# EAGLE design 119_02v2_INTELLIGENT_SENSOR_BOARD (EAGLE 9.6.2)
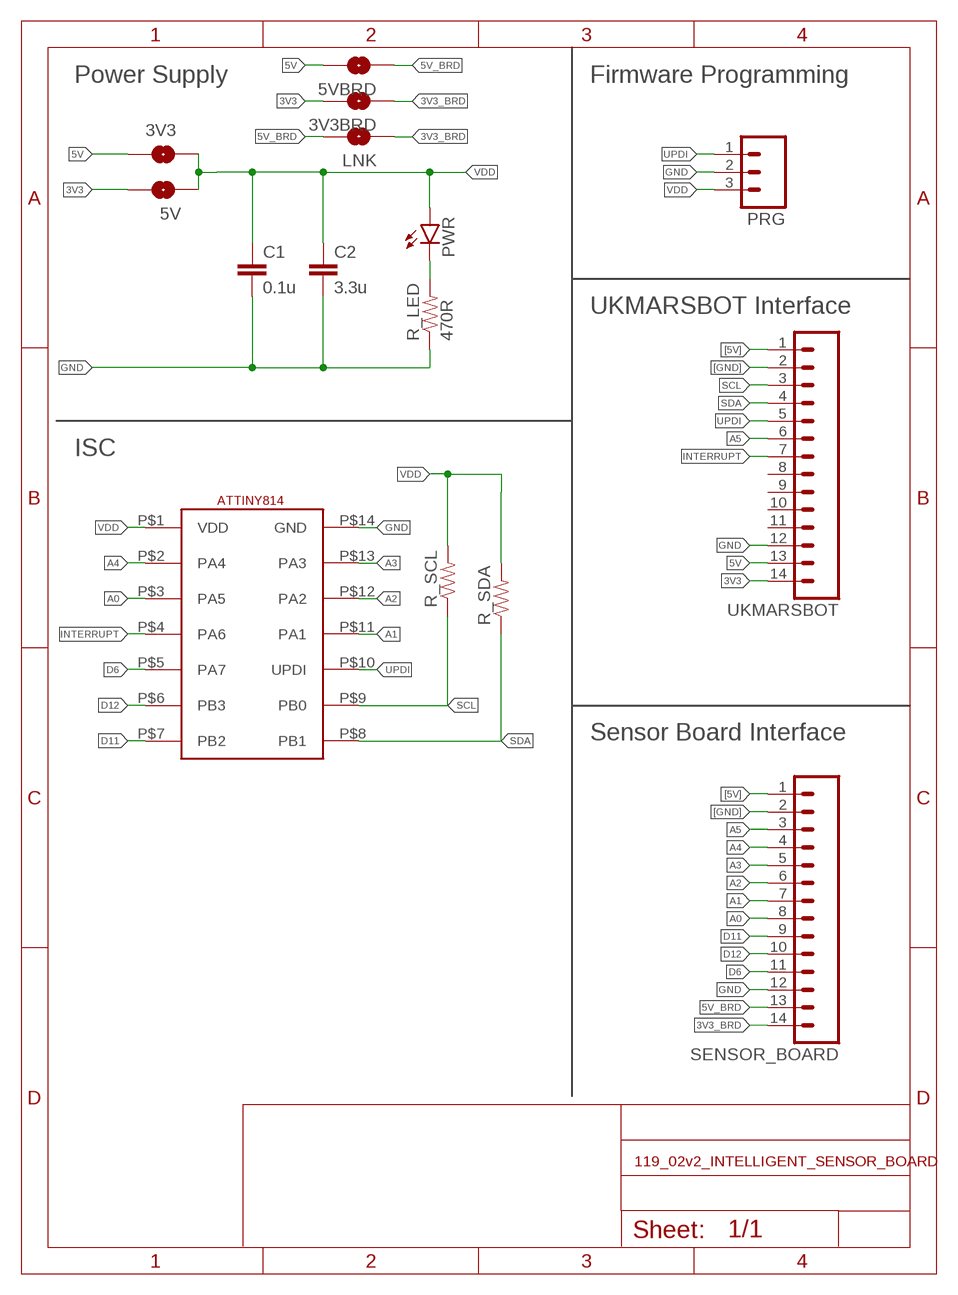
[diagram p0: schematic, sheet 1]

## Parts
3V3  JUMPER-SMT_2_NO_SILK  [SMT-JUMPER_2_NO_SILK]
3V3BRD  JUMPER-SMT_2_NO_SILK  [SMT-JUMPER_2_NO_SILK]
5V  JUMPER-SMT_2_NO_SILK  [SMT-JUMPER_2_NO_SILK]
5VBRD  JUMPER-SMT_2_NO_SILK  [SMT-JUMPER_2_NO_SILK]
C1  0.1u  CAP0805  [0805]
C2  3.3u  CAP0805  [0805]
LNK  JUMPER-SMT_2_NO_SILK  [SMT-JUMPER_2_NO_SILK]
PRG  M03PTH  [1X03]
PWR  LEDCHIP-LED0805  [CHIP-LED0805]
R_LED  470R  RESISTOR0805-RES  [0805]
R_SCL  RESISTOR0805-RES  [0805]
R_SDA  RESISTOR0805-RES  [0805]
SENSOR_BOARD  M14  [1X14]
U$1  ATTINY814  [ATTINY814]
UKMARSBOT  M14  [1X14]

## Nets
3V3: 3V3BRD.2 5V.2 UKMARSBOT.14
3V3_BRD: 3V3BRD.1 LNK.1 SENSOR_BOARD.14
5V: 3V3.2 5VBRD.2 UKMARSBOT.13
5V_BRD: 5VBRD.1 LNK.2 SENSOR_BOARD.13
[5V]: SENSOR_BOARD.1 UKMARSBOT.1
[GND]: SENSOR_BOARD.2 UKMARSBOT.2
A0: SENSOR_BOARD.8 U$1.P$3(PA5)
A1: SENSOR_BOARD.7 U$1.P$11(PA1)
A2: SENSOR_BOARD.6 U$1.P$12(PA2)
A3: SENSOR_BOARD.5 U$1.P$13(PA3)
A4: SENSOR_BOARD.4 U$1.P$2(PA4)
A5: SENSOR_BOARD.3 UKMARSBOT.6
D6: SENSOR_BOARD.11 U$1.P$5(PA7)
D11: SENSOR_BOARD.9 U$1.P$7(PB2)
D12: SENSOR_BOARD.10 U$1.P$6(PB3)
GND: C1.2 C2.2 PRG.2 R_LED.1 SENSOR_BOARD.12 U$1.P$14(GND) UKMARSBOT.12
INTERRUPT: U$1.P$4(PA6) UKMARSBOT.7
N$1: PWR.C R_LED.2
SCL: R_SCL.1 U$1.P$9(PB0) UKMARSBOT.3
SDA: R_SDA.1 U$1.P$8(PB1) UKMARSBOT.4
UPDI: PRG.1 U$1.P$10(UPDI) UKMARSBOT.5
VDD: 3V3.1 5V.1 C1.1 C2.1 PRG.3 PWR.A R_SCL.2 R_SDA.2 U$1.P$1(VDD)
Unconnected: UKMARSBOT.8 UKMARSBOT.9 UKMARSBOT.10 UKMARSBOT.11

## Notes on the sheet
- Power Supply | Firmware Programming
- UKMARSBOT Interface
- ISC
- Sensor Board Interface

## Library data of the parts
3V3 3V3BRD 5V 5VBRD LNK = SparkFun-Jumpers:JUMPER-SMT_2_NO: Normally open jumper This jumper has two pads in close proximity to each other. Apply solder to close the connection. Round pads are easier to solder for beginners, but are a lot larger. SparkFun Product that uses the round pads: SparkFun EL Sequencer <https://www.sparkfun.com/products/12781>
C1 C2 = SparkFun-Capacitors:CAP: Capacitor Standard 0603 ceramic capacitor, and 0.1" leaded capacitor.
PRG = SparkFun-Connectors:M03: Header 3 Standard 3-pin 0.1" header. Use with straight break away headers (SKU : PRT-00116), right angle break away headers (PRT-00553), swiss pins (PRT-00743), machine pins (PRT-00117), and female headers (PRT-00115). Molex polarized connector foot print use with SKU : PRT-08232 with associated crimp pins and housings.
PWR = led:LED: LED OSRAM: - CHIPLED LG R971, LG N971, LY N971, LG Q971, LY Q971, LO R971, LY R971 LH N974, LH R974 LS Q976, LO Q976, LY Q976 LO Q996 - Hyper CHIPLED LW Q18S LB Q993, LB Q99A, LB R99A - SideLED LS A670, LO A670, LY A670, LG A670, LP A670 LB A673, LV A673, LT A673, LW A673 LH A674 LY A675 LS A676, LA A676, LO A676, LY A676, LW A676 LS A679, LY A679, LG A679 - Hyper Micro SIDELED® LS Y876, LA Y876, LO Y876, LY Y876 LT Y87S - SmartLED LW L88C, LW L88S LB L89C, LB L89S, LG L890 LS L89K, LO L89K, LY L89K LS L896, LA L896, LO L896, LY L896 - TOPLED LS T670, LO T670, LY T670, LG T670, LP T670 LSG T670, LSP T670, LSY T670, LOP T670, LYG T670 LG T671, LOG T671, LSG T671 LB T673, LV T673, LT T673, LW T673 LH T674 LS T676, LA T676, LO T676, LY T676, LB T676, LH T676, LSB T676, LW T676 LB T67C, LV T67C, LT T67C, LS T67K, LO T67K, LY T67K, LW E67C LS E67B, LA E67B, LO E67B, LY E67B, LB E67C, LV E67C, LT E67C LW T67C LS T679, LY T679, LG T679 LS T770, LO T770, LY T770, LG T770, LP T770 LB T773, LV T773, LT T773, LW T773 LH T774 LS E675, LA E675, LY E675, LS T675 LS T776, LA T776, LO T776, LY T776, LB T776 LHGB T686 LT T68C, LB T68C - Hyper Mini TOPLED® LB M676 - Mini TOPLED Santana® LG M470 LS M47K, LO M47K, LY M47K Source: http://www.osram.convergy.de LUXEON: - LUMILED® LXK2-PW12-R00, LXK2-PW12-S00, LXK2-PW14-U00, LXK2-PW14-V00 LXK2-PM12-R00, LXK2-PM12-S00, LXK2-PM14-U00 LXK2-PE12-Q00, LXK2-PE12-R00, LXK2-PE12-S00, LXK2-PE14-T00, LXK2-PE14-U00 LXK2-PB12-K00, LXK2-PB12-L00, LXK2-PB12-M00, LXK2-PB14-N00, LXK2-PB14-P00, LXK2-PB14-Q00 LXK2-PR12-L00, LXK2-PR12-M00, LXK2-PR14-Q00, LXK2-PR14-R00 LXK2-PD12-Q00, LXK2-PD12-R00, LXK2-PD12-S00 LXK2-PH12-R00, LXK2-PH12-S00 LXK2-PL12-P00, LXK2-PL12-Q00, LXK2-PL12-R00 Source: www.luxeon.com KINGBRIGHT: KA-3528ASYC Source: www.kingbright.com
R_LED R_SCL R_SDA = SparkFun-Passives:RESISTOR: Resistor Basic schematic elements and footprints for 0603, 1206, and PTH resistors.
SENSOR_BOARD UKMARSBOT = SparkFun-Connectors:M14: Header 14 Standard 14-pin 0.1" header. Use with straight break away headers (SKU : PRT-00116), right angle break away headers (PRT-00553), swiss pins (PRT-00743), machine pins (PRT-00117), and female headers (PRT-00115).
U$1 = Stephen:ATTINY814

## Board
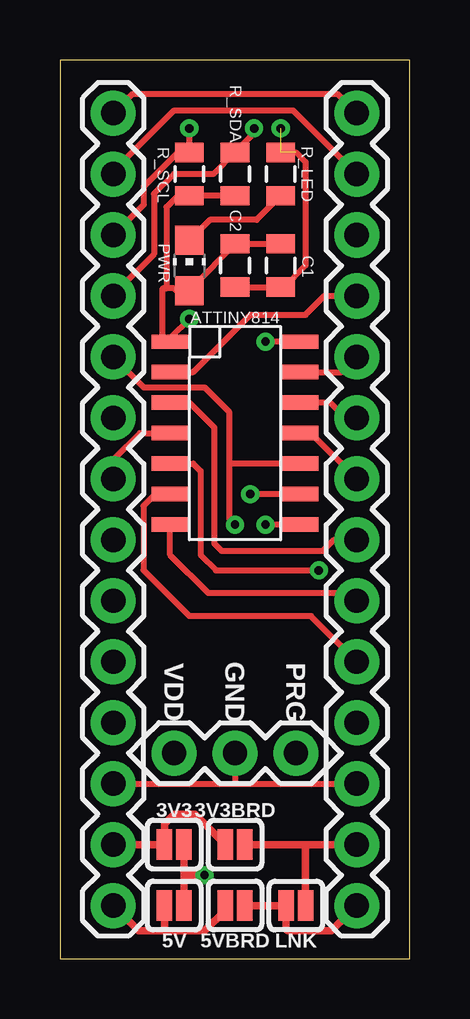
[diagram p1: board, top side]
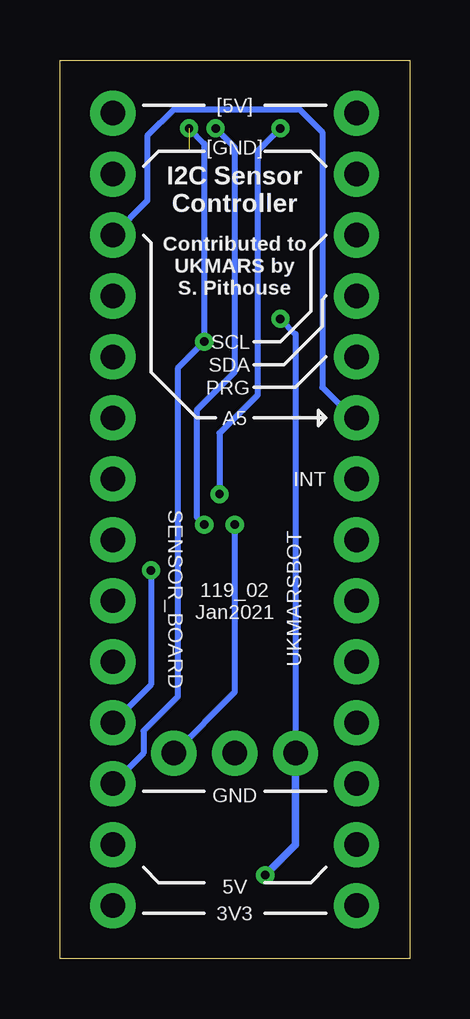
[diagram p2: board, bottom side, seen from below]

Size 14.59 x 37.45 mm. Coordinates in mm from the lower left corner, seen from the top.
Outline: 0,0 14.59,0 14.59,37.45 0,37.45 0,0
Copper layers (1*16): Top 0.035mm / dielectric 1.5mm / Bottom 0.035mm
Design rules "default *": minimum track width 6mil, minimum drill 0.35mm, track to track 6mil, track to pad 6mil, pad to pad 6mil, via to via 6mil, smd to smd 6mil, copper to edge 40mil, drill to drill 6mil, minimum pad ring 10mil, minimum via ring 8mil, stop-mask expansion 4mil, vias tented up to drill 36mil, thermal gap 10mil

### Footprints (pad centres in the part's own frame; a part is rotated, then mirrored left to right if it is on the bottom)
SMT-JUMPER_2_NO_SILK = smd 0.635 x 1.27: 1 -0.406,0; 2 0.406,0
0805 = smd 0.8 x 1.2: 1 -0.9,0; 2 0.9,0
1X03 = drill 1.016 pad 1.88: 1 0,0; 2 2.54,0; 3 5.08,0
CHIP-LED0805 = smd 1.2 x 1.2: A 0,-1.05; C 0,1.05
1X14 = drill 1.016 pad 1.88: 1 0,0; 2 2.54,0; 3 5.08,0; 4 7.62,0; 5 10.16,0; 6 12.7,0; 7 15.24,0; 8 17.78,0; 9 20.32,0; 10 22.86,0; 11 25.4,0; 12 27.94,0; 13 30.48,0; 14 33.02,0
ATTINY814 = smd 1.55 x 0.6: P$1 -2.7,3.175; P$2 -2.7,1.905; P$3 -2.7,0.635; P$4 -2.7,-0.635; P$5 -2.7,-1.905; P$6 -2.7,-3.175; P$7 -2.7,-4.445; P$8 2.7,-4.445; P$9 2.7,-3.175; P$10 2.7,-1.905; P$11 2.7,-0.635; P$12 2.7,0.635; P$13 2.7,1.905; P$14 2.7,3.175

### Placement (x,y rotation side)
3V3  4.76,4.76 180 top
3V3BRD  7.3,2.22 180 top
5V  4.76,2.22 180 top
5VBRD  7.3,4.76 180 top
C1  9.21,28.89 270 top
C2  7.3,28.89 270 top
LNK  9.84,2.22 0 top
PRG  9.84,8.57 180 top
PWR  5.4,28.89 0 top
R_LED  9.21,32.7 270 top
R_SCL  5.4,32.7 270 top
R_SDA  7.3,32.7 270 top
SENSOR_BOARD  12.38,35.24 270 top
U$1  7.3,22.54 0 top
UKMARSBOT  2.22,35.24 270 top

### Tracks (layer width: path | path; a pad name or v marks a point on that pad's centre or on a via)
3V3
  Top 0.305: UKMARSBOT.14 3.28,1.17 4.29,1.17 | 4.29,1.17 6.03,1.17 6.9,2.03 3V3BRD.2 | 5V.2 4.36,1.24 4.29,1.17
3V3_BRD
  Top 0.305: 3V3BRD.1 8.57,2.22 LNK.1 9.44,1.24 9.51,1.17 11.33,1.17 SENSOR_BOARD.14
5V
  Top 0.305: UKMARSBOT.13 3V3.2 4.36,5.63 4.76,6.03 5.63,6.03 5VBRD.2
5V_BRD
  Top 0.305: 5VBRD.1 10.32,4.76 | 10.32,4.76 SENSOR_BOARD.13 | 10.25,2.63 LNK.2 10.25,4.69 10.32,4.76
[5V]
  Top 0.254: SENSOR_BOARD.1 11.59,36.04 3.02,36.04 UKMARSBOT.1
[GND]
  Top 0.254: UKMARSBOT.2 2.22,32.82 4.76,35.36 9.73,35.36 SENSOR_BOARD.2
A0
  Top 0.254: U$1.P$3 5.4,23.18 6.44,22.13 6.44,17.3 6.76,16.99 10.95,16.99 11.43,17.46 SENSOR_BOARD.8
A1
  Top 0.254: U$1.P$11 10.48,21.91 SENSOR_BOARD.7
A2
  Top 0.254: SENSOR_BOARD.6 11.91,22.54 11.27,23.18 U$1.P$12
A3
  Top 0.254: U$1.P$13 11.75,24.45 SENSOR_BOARD.5
A4
  Top 0.254: U$1.P$2 5.56,24.45 7.95,26.84 10.24,26.84 11.03,27.62 SENSOR_BOARD.4
A5
  Bottom 0.254: SENSOR_BOARD.3 10.95,31.59 10.95,34.29 9.84,35.4 4.6,35.4 3.65,34.45 3.65,23.81 2.38,22.54 UKMARSBOT.6
D6  (via drill 0.35)
  Top 0.254: U$1.P$5 5.56,20.64 5.87,20.32 5.87,16.83 6.51,16.19 v10.79,16.19
  Bottom 0.254: v10.79,16.19 10.79,11.43 SENSOR_BOARD.11
D11
  Top 0.254: SENSOR_BOARD.9 12.07,15.24 6.19,15.24 4.6,16.83 U$1.P$7
D12
  Top 0.254: SENSOR_BOARD.10 10.48,14.29 5.4,14.29 3.49,16.2 3.48,18.88 3.97,19.37 U$1.P$6
GND  (via drill 0.35)  (2 unrouted)
  Top 0.254: C2.2 C1.2 9.35,27.99 10.25,28.89 10.25,33.2 9.84,33.6 | UKMARSBOT.12 7.3,7.3 | 7.3,7.3 SENSOR_BOARD.12 | U$1.P$14 v8.57,25.72 | PRG.2 7.3,7.3
  Bottom 0.254: v9.21,34.61 8.57,33.97 v8.57,25.72 9.68,24.61 9.68,10.93 11.11,9.5 11.11,8.57 SENSOR_BOARD.12
INTERRUPT
  Top 0.254: UKMARSBOT.7 2.22,20.8 3.33,21.91 U$1.P$4
N$1
  Top 0.254: R_LED.2 8.2,30.8 6.25,30.8 PWR.C
SCL  (via drill 0.35)
  Top 0.254: U$1.P$9 v7.94,19.37 | UKMARSBOT.3 3.49,31.43 3.49,32.17 4.92,33.6 R_SCL.1 v5.4,34.61
  Bottom 0.254: v5.4,34.61 6.35,33.66 6.35,23.5 7.94,21.91 v7.94,19.37
SDA  (via drill 0.35)
  Top 0.254: U$1.P$8 v8.57,18.1 | UKMARSBOT.4 2.22,27.67 3.92,29.37 3.92,31.87 4.75,32.7 6.4,32.7 R_SDA.1 8.1,34.4 v8.1,34.61
  Bottom 0.254: v8.1,34.61 7.3,33.81 7.3,24.45 8.89,22.86 8.89,18.41 v8.57,18.1
UPDI  (via drill 0.35)
  Top 0.254: UKMARSBOT.5 3.49,23.81 6.03,23.81 7.06,22.78 7.06,20.64 | v7.3,18.1 7.06,18.34 7.06,20.64 | U$1.P$10 7.06,20.64
  Bottom 0.254: PRG.1 7.3,11.11 v7.3,18.1
VDD  (via drill 0.35)
  Top 0.254: C1.1 C2.1 5.55,27.99 PWR.A 4.86,27.84 4.76,27.94 4.45,27.94 | R_SDA.2 R_SCL.2 4.92,31.8 4.45,31.33 4.45,27.94 | 4.45,27.94 4.29,27.94 4.29,25.72 U$1.P$1 4.6,25.87 v5.4,26.67
  Top 0.305: 5V.1 5.17,3.49 | 5.17,3.49 3V3.1 | 5.17,3.49 v6.03,3.49
  Bottom 0.254: v5.4,26.67 4.76,26.03 PRG.3
  Bottom 0.305: v6.03,3.49 4.76,4.76 PRG.3

### Text on the board
tNames: VDD | GND | PRG
bNames: [5V] | [GND] | I2C Sensor / Controller | Contributed to / UKMARS by / S. Pithouse | SCL | SDA | PRG | A5 | INT | 119_02 / Jan2021 | GND | 5V | 3V3